# Altium schematic sheet SAMC21N_Xplained_Pro_dual_input_power_supply.SchDoc: Power supply
size A3; Organization: Microchip India; DocumentNumber: A09-2682; Revision: 4; SheetNumber: 2; SheetTotal: 9; CheckedBy: M.S.K; DrawnBy: Microchip India; PageSetup: Record=PageOptions|CenterHorizontal=True|CenterVertical=True|PrintScale=0.71|XCorrection=1.00|YCorrection=1.00|PrintKind=0|BorderSize=5000000|LeftOffset=0|BottomOffset=0|Orientation=2|PaperLength=1000|PaperWidth=1000|Scale=100|PaperSource=15|PrintQuality=600|MediaType=1|DitherType=10|PrintScaleMode=1|PaperKind=A4 (210 x 297 mm)|PaperIndex=9; PCBNumber: A08-2581; PCBRevision: 2; ProjectTitle: ATSAMC21N-XPRO
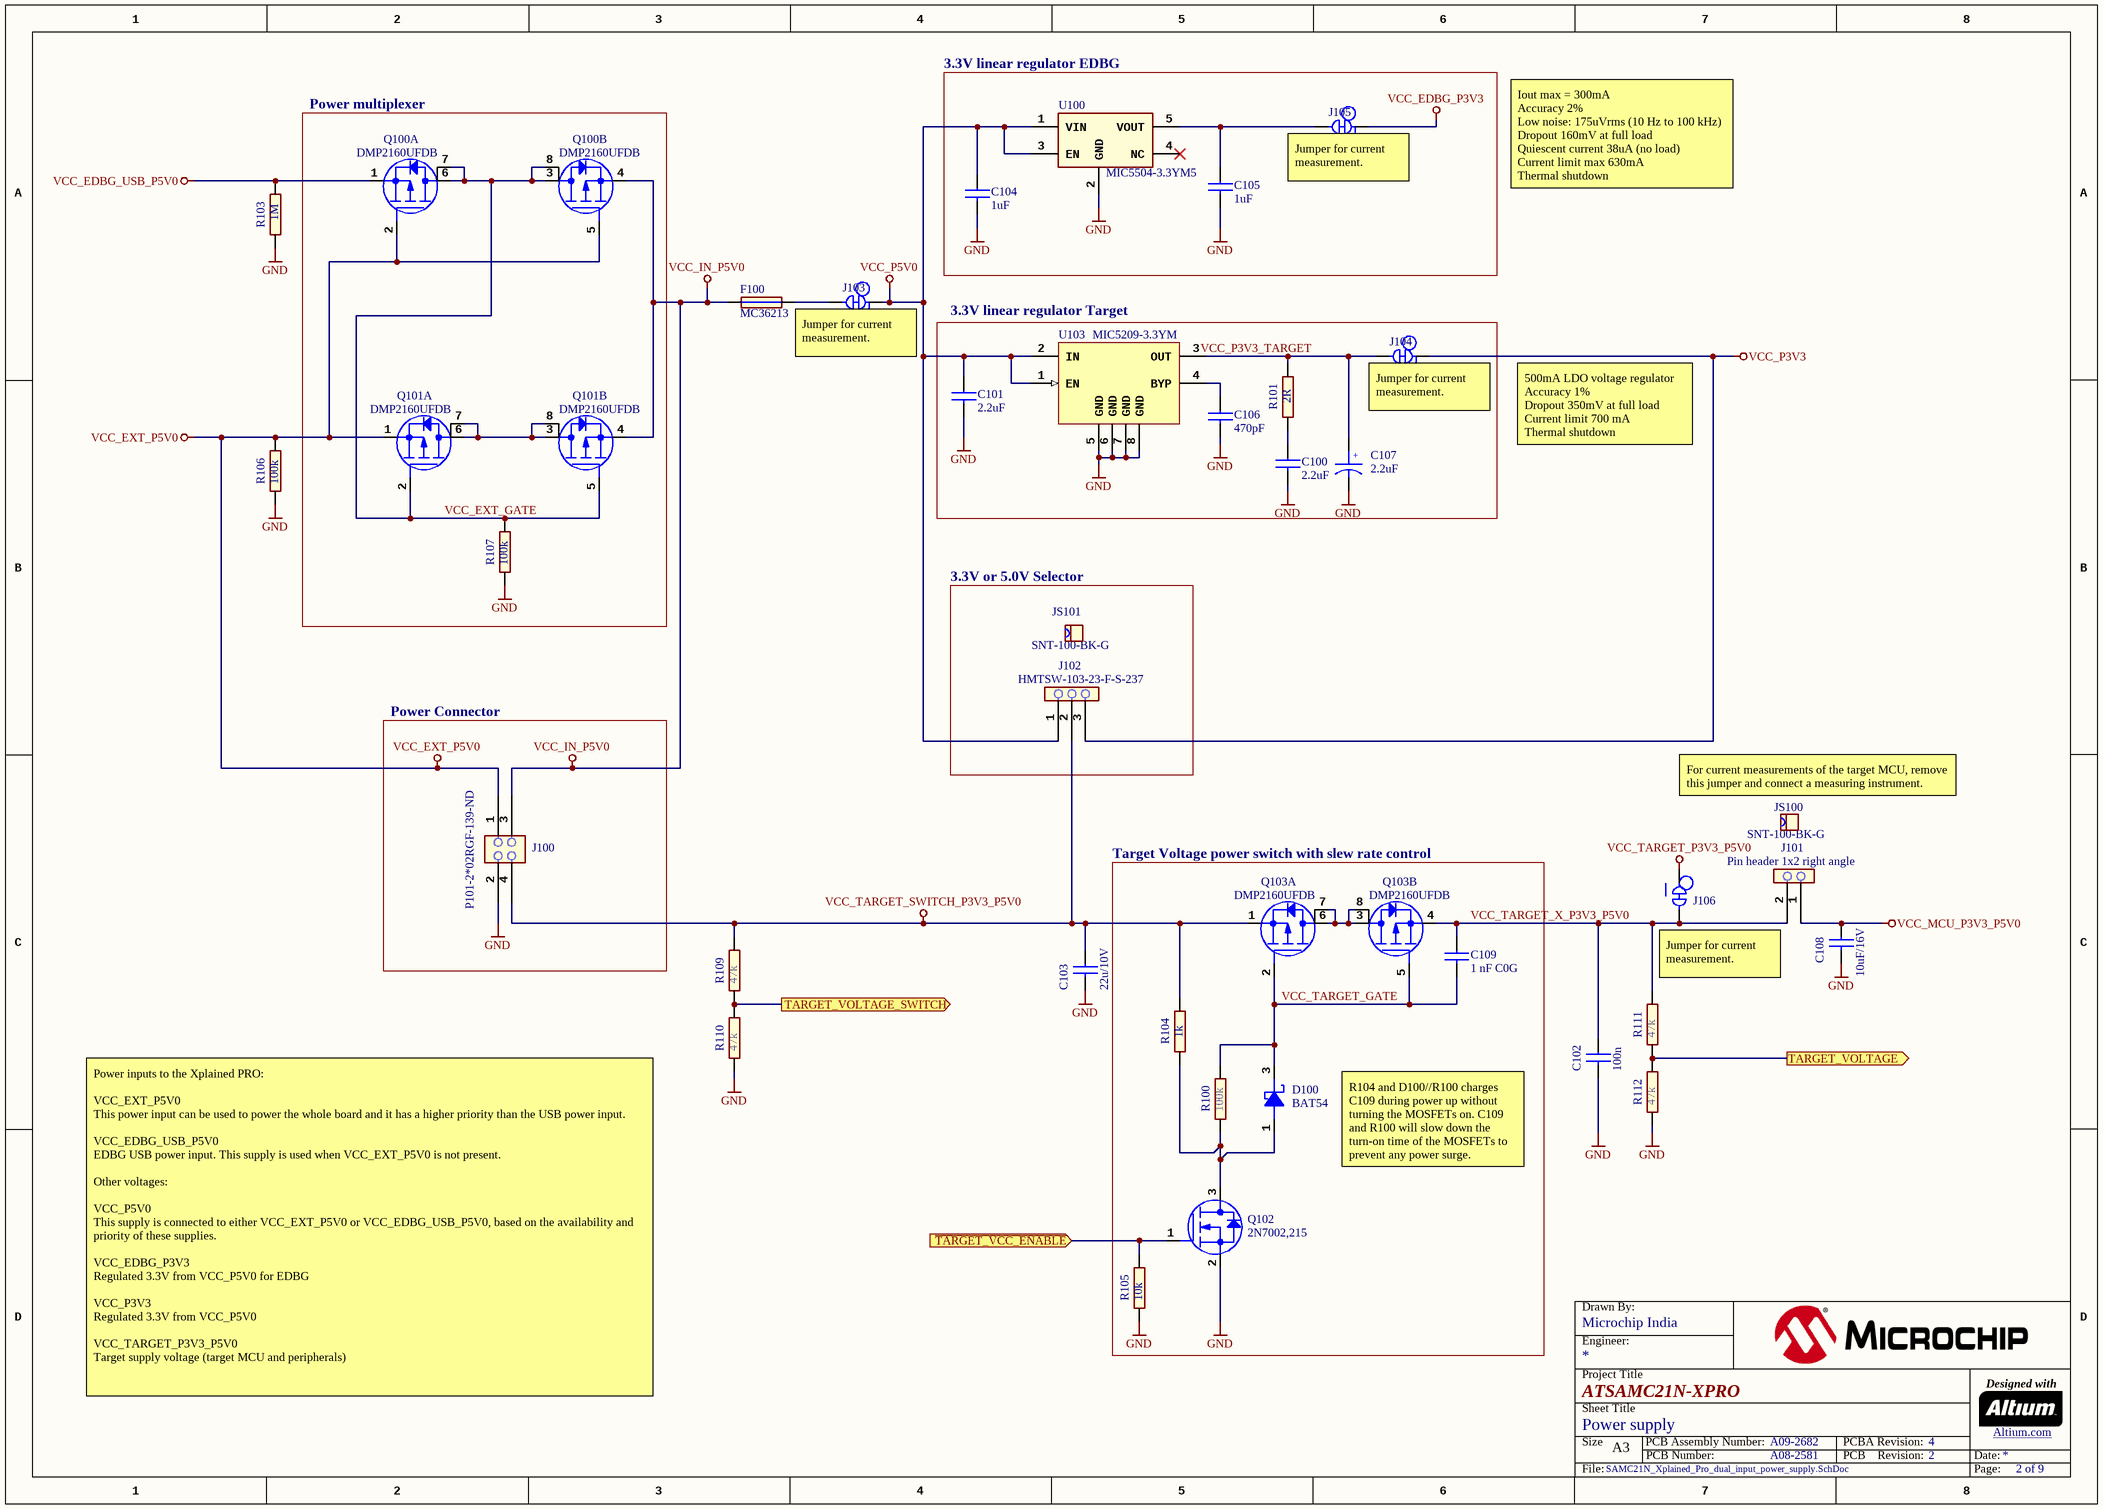
[diagram p0: SAMC21N_Xplained_Pro_dual_input_power_supply.SchDoc]

## Parts
C100  value 2.2uF  [AP1-00096]  (hidden comment: CAP-NONPOL)
C101  value 2.2uF  [AP1-00096]  (hidden comment: CAP-NONPOL)
C102  value 100n  [AP1-00001]  (hidden comment: CAP-NONPOL)
C103  value 22u/10V  [AP1-00003]  (hidden comment: CAP-NONPOL)
C104  value 1uF  [AP1-00001]  (hidden comment: 490-3890-2-ND@digikey)
C105  value 1uF  [AP1-00001]  (hidden comment: 490-3890-2-ND@digikey)
C106  value 470pF  [AP1-00001]  (hidden comment: CAP-NONPOL)
C107  value 2.2uF  [AP1-00036]  (hidden comment: CAP-POL)
C108  value 10uF/16V  [AP1-00039]  (hidden comment: CAP-NONPOL)
C109  1 nF C0G  [AP1-00053]
D100  value BAT54  [AP4-00007]  (hidden comment: SCHOTTKY_SMD_31)
F100  value MC36213  [AP2-00002]  (hidden comment: Farnell no: 1861197)
J100  value P101-2*02RGF-139-ND  [AP8-00628]  (hidden comment: HEADER 2x2)
J101  value Pin header 1x2 right angle  [AP8-00367]  (hidden comment: HEADER 1x2)
J102  value HMTSW-103-23-F-S-237  [AP8-00745]  (hidden comment: Same as A08-1614 but with 1mm hole for optimal reflow soldering (no misalignment of the component))
J103  SMD-STRAP_CLOSED  [AP9-00044]  (value not drawn)  (net tie, no BOM)
J104  SMD-STRAP_CLOSED  [AP9-00044]  (value not drawn)  (net tie, no BOM)
J105  SMD-STRAP_CLOSED  [AP9-00044]  (value not drawn)  (net tie, no BOM)
J106  SMD-STRAP_CLOSED  [AP9-00044]  (value not drawn)  (net tie, no BOM)
JS100  value SNT-100-BK-G  [AP8-00525]  (hidden comment: To be used by request from ESCATEC)
JS101  value SNT-100-BK-G  [AP8-00525]  (hidden comment: To be used by request from ESCATEC)
Q100  value DMP2160UFDB  [AP5-00047]  (hidden comment: MOSFET_DUAL_P_S1G1D2S2G2D1D1D2)  (parts A,B of 2)
Q101  value DMP2160UFDB  [AP5-00047]  (hidden comment: MOSFET_DUAL_P_S1G1D2S2G2D1D1D2)  (parts A,B of 2)
Q102  value 2N7002,215  [AP5-00002]  (hidden comment: MOSFET_N_GSD)
Q103  value DMP2160UFDB  [AP5-00047]  (hidden comment: MOSFET_DUAL_P_S1G1D2S2G2D1D1D2)  (parts A,B of 2)
R100  value 100k  [AP2-00000]  (hidden comment: R2)
R101  value 2R  [AP2-00000]  (hidden comment: R2)
R103  value 1M  [AP2-00000]  (hidden comment: R2)
R104  value 1k  [AP2-00000]  (hidden comment: R2)
R105  value 10k  [AP2-00000]  (hidden comment: R2)
R106  value 100k  [AP2-00000]  (hidden comment: R2)
R107  value 100k  [AP2-00000]  (hidden comment: R2)
R109  value 47k  [AP2-00000]  (hidden comment: R2)
R110  value 47k  [AP2-00000]  (hidden comment: R2)
R111  value 47k  [AP2-00000]  (hidden comment: R2)
R112  value 47k  [AP2-00000]  (hidden comment: R2)
U100  value MIC5504-3.3YM5  [AP6-00087]  (hidden comment: MIC5504)
U103  MIC5209-3.3YM  [AP6-00000]

## Blocks framed on the sheet
Power multiplexer: Q100 Q101 R107
3.3V linear regulator EDBG: C104 C105 J105 U100
3.3V linear regulator Target: C100 C101 C106 C107 J104 R101 U103
3.3V or 5.0V Selector: J102 JS101
Power Connector: J100
Target Voltage power switch with slew rate control: C109 D100 Q102 Q103 R100 R104 R105

## Ports
TARGET_VOLTAGE (out), TARGET_VOLTAGE_SWITCH (out), ~{TARGET_VCC_ENABLE} (in)

## Nets
GND: C100.2 C101.2 C102.2 C103.2 C104.2 C105.2 C106.2 C107.2 C108.2 J100.2 Q102.2(S) R103.1 R105.1 R106.1 R107.1 R110.1 R112.1 U100.2(GND) U103.5(GND) U103.6(GND) U103.7(GND) U103.8(GND)
VCC_EDBG_P3V3: J105.1
VCC_EDBG_USB_P5V0: Q100.1(S1) R103.2
VCC_EXT_P5V0: J100.1 Q100.2(G1) Q100.5(G2) Q101.1(S1) R106.2
VCC_IN_P5V0: F100.1 J100.3 Q100.4(S2) Q101.4(S2)
VCC_MCU_P3V3_P5V0: C108.1 J101.1
VCC_P3V3: J102.3 J104.1
VCC_P5V0: C101.1 C104.1 J102.1 J103.1 U100.1(VIN) U100.3(EN) U103.1(EN) U103.2(IN)
VCC_TARGET_P3V3_P5V0: J106.1
VCC_TARGET_SWITCH_P3V3_P5V0: C103.1 J100.4 J102.2 Q103.1(S1) R104.2 R109.2
~{TARGET_VCC_ENABLE}: Q102.1(G) R105.2 ; port ~{TARGET_VCC_ENABLE}
TARGET_VOLTAGE: R111.1 R112.2 ; port TARGET_VOLTAGE
TARGET_VOLTAGE_SWITCH: R109.1 R110.2 ; port TARGET_VOLTAGE_SWITCH
VCC_EXT_GATE: Q100.3(D2) Q100.6(D1) Q100.7(D1_PAD) Q100.8(D2_PAD) Q101.2(G1) Q101.5(G2) R107.2
VCC_TARGET_GATE: C109.2 D100.3(CATHODE) Q103.2(G1) Q103.5(G2) R100.2
VCC_TARGET_X_P3V3_P5V0: C102.1 C109.1 J101.2 J106.2 Q103.4(S2) R111.2
NetC100_1: C100.1 R101.1
NetC105_1: C105.1 J105.2 U100.5(VOUT)
NetC106_1: C106.1 U103.4(BYP)
NetC107_1: C107.1 J104.2 R101.2 U103.3(OUT)
NetD100_1: D100.1(ANODE) Q102.3(D) R100.1 R104.1
NetF100_2: F100.2 J103.2
NetQ101_3: Q101.3(D2) Q101.6(D1) Q101.7(D1_PAD) Q101.8(D2_PAD)
NetQ103_3: Q103.3(D2) Q103.6(D1) Q103.7(D1_PAD) Q103.8(D2_PAD)

Not connected (* = marked no-connect by the designer): U100 4(NC)*

## Notes on the sheet
- (near J105) Jumper for current measurement.
- Iout max = 300mA
  Accuracy 2%
  Low noise: 175uVrms (10 Hz to 100 kHz)
  Dropout 160mV at full load
  Quiescent current 38uA (no load)
  Current limit max 630mA
  Thermal shutdown
- (near J103) Jumper for current measurement.
- (near J104) Jumper for current measurement.
- 500mA LDO voltage regulator
  Accuracy 1%
  Dropout 350mV at full load
  Current limit 700 mA
  Thermal shutdown
- (near JS100) For current measurements of the target MCU, remove this jumper and connect a measuring instrument.
- Jumper for current measurement.
- R104 and D100//R100 charges C109 during power up without turning the MOSFETs on. C109 and R100 will slow down the turn-on time of the MOSFETs to prevent any power surge.
- Power inputs to the Xplained PRO:
  VCC_EXT_P5V0
  This power input can be used to power the whole board and it has a higher priority than the USB power input.
  VCC_EDBG_USB_P5V0
  EDBG USB power input. This supply is used when VCC_EXT_P5V0 is not present.
  Other voltages:
  VCC_P5V0
  This supply is connected to either VCC_EXT_P5V0 or VCC_EDBG_USB_P5V0, based on the availability and priority of these supplies.
  VCC_EDBG_P3V3
  Regulated 3.3V from VCC_P5V0 for EDBG
  VCC_P3V3
  Regulated 3.3V from VCC_P5V0
  VCC_TARGET_P3V3_P5V0
  Target supply voltage (target MCU and peripherals)
- Labels drawn without touching a wire or pin: VCC_P3V3_TARGET
- Drawn By:
- Project Title
- Engineer:
- Designed with
- Sheet Title
- Size
- A3
- PCB Number:
- PCB Assembly Number:
- PCBA Revision:
- PCB    Revision:
- Date:
- Altium.com <http://go.altium.com/MicrochipLandingPage_Evaluation.html>
- File:
- Page:
- (in symbol A01-0492) +

## Library data of the parts
C100 C101 = A01-0691: Ceramic capacitor, SMD 0603, X7R, 10V, 10%; PartGroup: Capacitors,Ceramic,SMD 0603; Manufacturer: Murata; MPN: GRM188R71A225KE15D; TemperatureRange: -55 to +125 deg C; ComponentStatus: 'Active (verified)'; Status: Active; Verified by: Lars Helge Mo; Verified date: 2005-12-15; AN: A01-0691; Tolerance: 10%; Height: 0.800000011920929; FootprintStatus: 'Active (Verified)'
C102 = A01-0246: Ceramic capacitor, SMD 0402, X7R, 16V, +/-10%; PartGroup: Capacitors,Ceramic,SMD 0402; Manufacturer: Kemet; MPN: C0402C104K4RACTU; TemperatureRange: -55 - +125 deg C; ComponentStatus: 'Active (verified)'; Status: Active; Verified by: Lars Helge Mo; Verified date: 2005-12-15; AN: A01-0246; Tolerance: 16V, +/-10%; Height: 0,5; FootprintStatus: 'Active (Verified)'
C103 = A01-0500: Ceramic capacitor, SMD 0805, X5R, 10V, Â±20%; PartGroup: Capacitors,Ceramic,SMD 0805; Manufacturer: tdk; MPN: C2012X5R1A226M/0.85; TemperatureRange: -55Â°C to +85Â°C; ComponentStatus: 'Active (verified)'; Status: Active; Verified by: Lars Helge Mo; Verified date: 2005-12-15; AN: A01-0500; Height: 0.949999988079071; FootprintStatus: 'Active (Verified)'
C104 C105 = A01-0618: Ceramic capacitor, SMD 0402, X5R, 10V, 10%; PartGroup: Capacitors,Ceramic,SMD 0402; Manufacturer: Murata; MPN: GRM155R61A105KE15D; TemperatureRange: -55 to +85 deg C; ComponentStatus: 'Active (verified)'; Status: Active; Verified by: Lars Helge Mo; Verified date: 2005-12-15; AN: A01-0618; Tolerance: 10%; Height: 0.550000011920929; FootprintStatus: 'Active (Verified)'
C106 = A01-0322: Ceramic capacitor, SMD 0402, NP0, 50V, +/-5%; PartGroup: Capacitors,Ceramic,SMD 0402; Manufacturer: Murata; MPN: GRM1555C1H471JA01D; TemperatureRange: -55 - +125 deg C; ComponentStatus: 'Active (verified)'; Status: Active; Verified by: Lars Helge Mo; Verified date: 2005-12-15; AN: A01-0322; Tolerance: 50V, +/-5%; Height: 0.5; FootprintStatus: 'Active (Verified)'
C107 = A01-0492: Capacitor Tantalum 10V 2.2uF 10% ESR = 6 ohm; PartGroup: Capacitors,Tantalum; Manufacturer: Kemet; MPN: T494A225K010AT; TemperatureRange: - 55 C to + 125 C; ComponentStatus: 'Active (verified)'; Status: Active; Verified date: 2006-02-03; Verified by: Ketil Skjerve; AN: A01-0492; Tolerance: ±10%; Height: 1.79999995231628; FootprintStatus: 'Active (Verified)'
C108 = A01-0491: Ceramic capacitor, SMD 0603, X5R, 16V, 10UF ± 20% (High Density); PartGroup: Capacitors,Ceramic,SMD 0603; Manufacturer: Taiyo Yuden; MPN: EMK107BBJ106MA-T; Tolerance: ­± 20%; TemperatureRange: -55°C to +85°C; ComponentStatus: 'Active (verified)'; Status: Active; Verified by: Lars Helge Mo; Verified date: 2005-12-15; AN: A01-0491; Height: 0,819999992847443; FootprintStatus: 'Active (Verified)'
C109 = A01-0321: Ceramic capacitor, SMD 0402, C0G, 50V, +/-5%; PartGroup: Capacitors,Ceramic,SMD 0402; Manufacturer: Murata; MPN: GRM1555C1H102JA01D; Tolerance: 5%; ComponentStatus: 'Active (verified)'; Status: Active; Verified by: Lars Helge Mo; Verified date: 2005-12-15; AN: A01-0321; Value: 1 nF C0G; FootprintStatus: 'Active (Verified)'
D100 = A04-0001: Schottky diode, V(rrm)=30V, I(f)=0.1A, V(f)=0.4V (at If = 0.01A), I(r)=0.5uA (at Vrrm), t(rr)=5ns, SMD SOT23; PartGroup: Diodes,Schottky; Manufacturer: Philips; NC: 2; TemperatureRange: -40 - +85 deg C; ComponentStatus: 'Active (verified)'; Status: Active; Verified by: Ketil Skjerve; Verified date: 2006-06-28; AN: A04-0001; Height: 1,10000002384186; MPN: BAT54; FootprintStatus: 'Active (Verified)'
F100 = A02-0622: Resetable PTC fuse, Ih = 0.5A, It = 1.0A, 0805 package; PartGroup: Resistors,Resettable fuses,SMD; Manufacturer: Multicomp; TemperatureRange: -40°C to + 85°C; ComponentStatus: 'Active (verified)'; Verified date: 2006-01-30; Verified by: Ketil Skjerve; Status: Active; AN: A02-0622; Height: 1.25; MPN: MC36213; FootprintStatus: 'Active (Verified)'
J100 = A08-1519: Pin header, 2x2, Right Angle, 2.54mm, THT, Pin In Paste; PartGroup: Mechanical devices,Connectors,Pin headers; ComponentStatus: 'New (not verified)'; Verified date: 2005-12-19; Verified by: Lars Helge Mo; Status: Active; AN: A08-1519; Height: 5.07999992370605; MPN: P101-2*02RGF-139-ND; FootprintStatus: 'New (Not verified)'
J101 = A08-0764: 1x2 pin header, right angle, 2.54 mm pitch, through-hole; PartGroup: Mechanical devices,Connectors,Pin headers; Manufacturer: Pro-data International Corp; MPN: 2213R-2G; ComponentStatus: 'Active (verified)'; Verified date: 2006-01-30; Verified by: Lars Helge; Status: Active; AN: A08-0764; Height: 2.53999996185303; FootprintStatus: 'Active (Verified)'
J102 = A08-1799: 1x3 pin header, 2.54mm pitch, Pin-in-Paste THM, 1mm hole; PartGroup: Mechanical devices,Connectors,Pin headers; Manufacturer: SAMTEC; ComponentStatus: 'Active (verified)'; Verified date: 2006-01-30; Verified by: Lars Helge Mo; Status: Active; AN: A08-1799; Height: 6.09999990463257; MPN: HMTSW-103-23-F-S-237; FootprintStatus: 'New (Not verified)'
J103-J106 = A09-0783: Default closed SMD strap, 0603 size; PartGroup: Mechanical devices,PCB implemented components; Value: SMD-STRAP_0603_CLOSED; ComponentStatus: 'Active (verified)'; AN: A09-0783; Height: 0; FootprintStatus: 'Active (Verified)'
JS100 JS101 = A08-0543: Jumper cap for 2.54mm pinheader; PartGroup: Mechanical devices,Mounting accessories,Other; Manufacturer: SAMTEC; ComponentStatus: 'Active (verified)'; Verified date: 2006-04-05; Verified by: Lars Helge Mo; Status: Active; AN: A08-0543; MPN: SNT-100-BK-G; FootprintStatus: 'Active (Verified)'
Q100 Q101 Q103 = A05-0171: MOSFET 20V 3.8A DUAL P-CHAN, Rds 70 mOhms, Vgs 12V, Vds -20; PartGroup: Transistors,Power FET,SMD; Manufacturer: Diodes Incorporated; MPN: DMP2160UFDB-7; TemperatureRange: -55 C to +150 C; ComponentStatus: 'Active (verified)'; AN: A05-0171; Height: 0.605000019073486; FootprintStatus: 'Active (Verified)'
Q102 = A05-0085: N-Channel MOSFET. 60V, 0.300A continuous, 1.2A Peak. RDS(ON) = 3.8Ohm@VGS=4.5V, VGS(th)<2.5V; PartGroup: Transistors,Small signal FET,SMD; Manufacturer: NXP; TemperatureRange: -65 to 150 deg C; ComponentStatus: 'Active (verified)'; Status: New; AN: A05-0085; Height: 1.10000002384186; MPN: 2N7002,215; FootprintStatus: 'Active (Verified)'
R100 = A02-0260: Thick film resistor, SMD 0402, 1/16W, 1%; PartGroup: Resistors,SMD,0402 1%; TemperatureRange: -55ï¿½ to +125ï¿½C; ComponentStatus: 'Active (verified)'; Status: Active; Verified by: Lars Helge Mo; Verified date: 2005-12-19; AN: A02-0260; Tolerance: 1 %; Height: 0,349999994039536; FootprintStatus: 'Active (Verified)'
R101 = A02-1147: RES SMD 2 OHM 1% 1/16W 0402; Status: Active; Verified by: Lars Helge Mo; Verified date: 2005-12-19; AN: A02-1147
R103 = A02-0284: Thick film resistor, SMD 0402, 1/16W, 1%; PartGroup: Resistors,SMD,0402 1%; TemperatureRange: -55 - +125 deg C; ComponentStatus: 'Active (verified)'; Status: Active; Verified by: Lars Helge Mo; Verified date: 2005-12-19; AN: A02-0284; Tolerance: 1 %; Height: 0.349999994039536; FootprintStatus: 'Active (Verified)'
R104 = A02-0212: Thick film resistor, SMD 0402, 1/16W, 1%; PartGroup: Resistors,SMD,0402 1%; TemperatureRange: -55 - +125 deg C; ComponentStatus: 'Active (verified)'; Status: Active; Verified by: Lars Helge Mo; Verified date: 2005-12-19; AN: A02-0212; Tolerance: 1 %; Height: 0,349999994039536; FootprintStatus: 'Active (Verified)'
R105 = A02-0236: Thick film resistor, SMD 0402, 1/16W, 1%; PartGroup: Resistors,SMD,0402 1%; Manufacturer: vishay; MPN: CRCW040210K0FKED; TemperatureRange: -55 - +125 deg C; ComponentStatus: 'Active (verified)'; Status: Active; Verified by: Lars Helge Mo; Verified date: 2005-12-19; AN: A02-0236; Tolerance: 1 %; Height: 0,349999994039536; FootprintStatus: 'Active (Verified)'
R106 R107 = A02-0260: Thick film resistor, SMD 0402, 1/16W, 1%; PartGroup: Resistors,SMD,0402 1%; TemperatureRange: -55 - +125 deg C; ComponentStatus: 'Active (verified)'; Status: Active; Verified by: Lars Helge Mo; Verified date: 2005-12-19; AN: A02-0260; Tolerance: 1 %; Height: 0.349999994039536; FootprintStatus: 'Active (Verified)'
R109-R112 = A02-0252: Thick film resistor, SMD 0402, 1/16W, 1%; PartGroup: Resistors,SMD,0402 1%; TemperatureRange: -55 - +125 deg C; ComponentStatus: 'Active (verified)'; Status: Active; Verified by: Lars Helge Mo; Verified date: 2005-12-19; AN: A02-0252; Tolerance: 1 %; Height: 0.349999994039536; FootprintStatus: 'Active (Verified)'
U100 = A06-1476: LDO 3.3V 0.3A SOT-23-5; PartGroup: Integrated Circuits,Regulators,Linear; Manufacturer: Microchip; MPN: MIC5504-3.3YM5-TR; TemperatureRange: -40Â°C ~ 125Â°C; ComponentStatus: 'Active (verified)'; AN: A06-1476; Design Comment: *; Verified by: *; Verified date: *; Height: 1.45000004768372; FootprintStatus: 'Active (Verified)'
U103 = A06-1496: Fixed 3.3V, 500mA Low-Noise LDO Regulator, SOIC-8; PartGroup: Integrated Circuits,Regulators,Linear; Manufacturer: Microchip; TemperatureRange: -40Â°C ~ 125Â°C; ComponentStatus: 'Active (verified)'; Status: New; Value: MIC5209-3.3YM; AN: A06-1496; Height: 1.62999999523163; MPN: MIC5209-3.3YM; FootprintStatus: 'Active (Verified)'